# EAGLE design Shield (EAGLE 7.2.0)
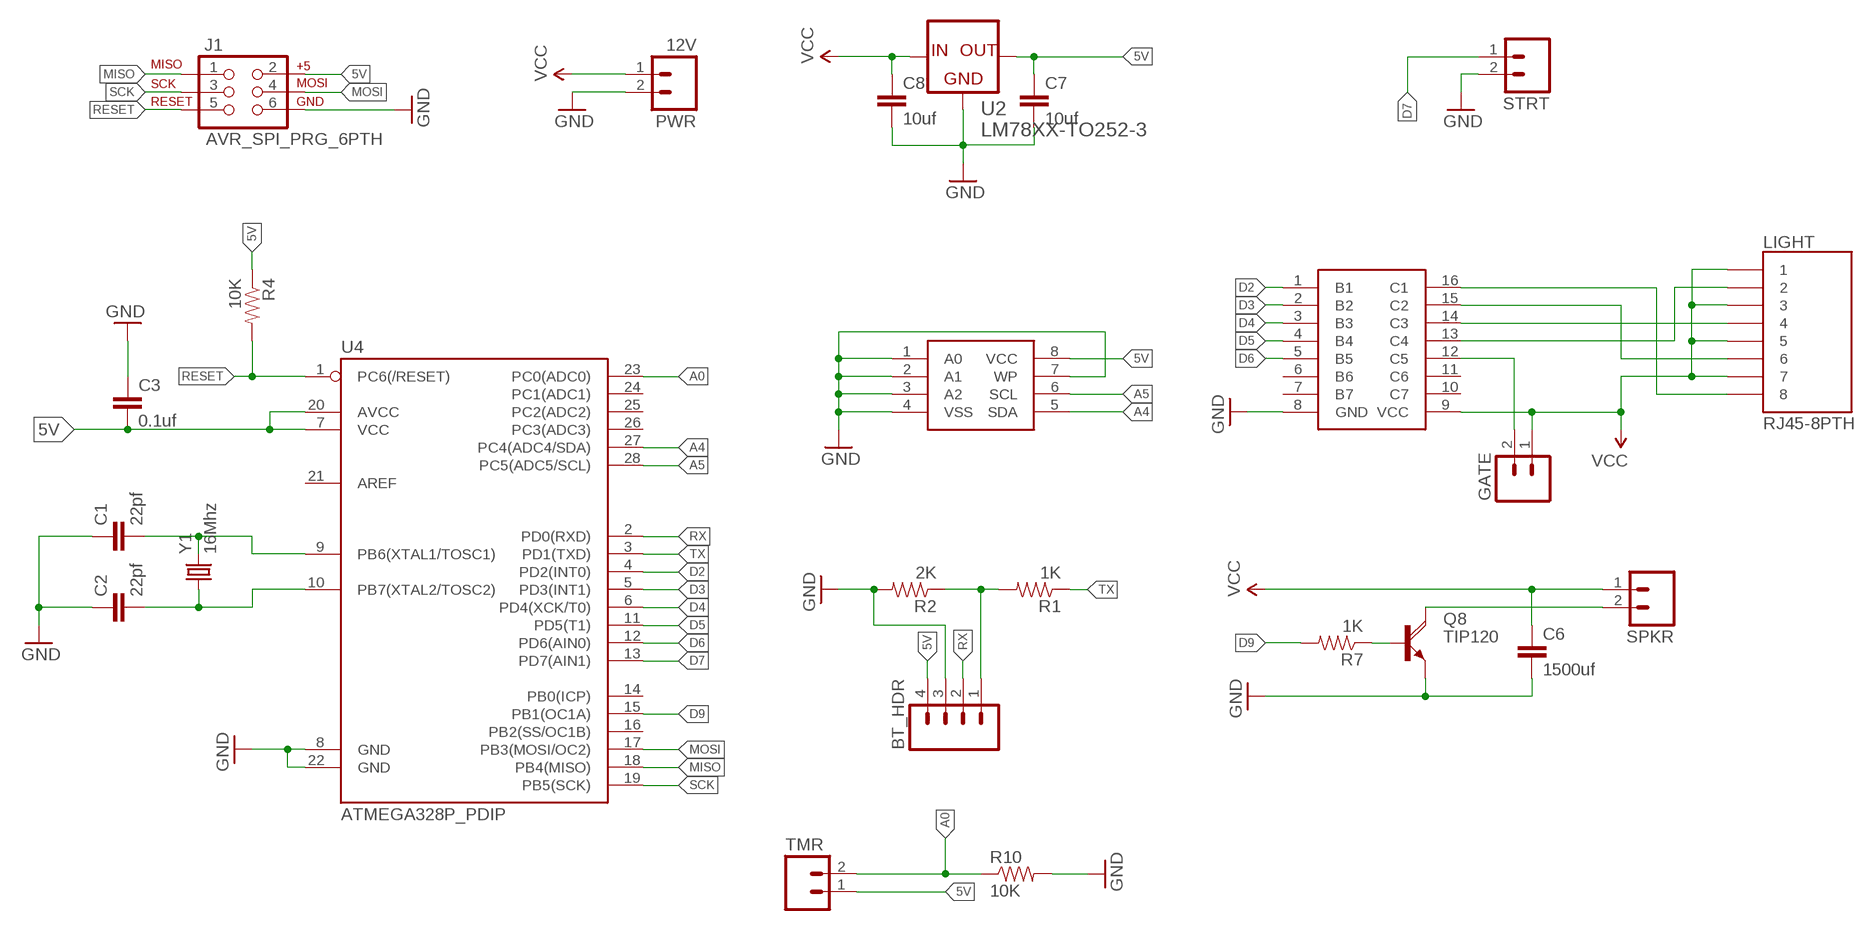
[diagram p0: schematic, sheet 1]

## Parts
BT_HDR  M04PTH  [1X04]
C1  22pf  CAP1206  [1206]
C2  22pf  CAP1206  [1206]
C3  0.1uf  CAP1206  [1206]
C6  1500uf  CAPPTH1  [CAP-PTH-5MM]
C7  10uf  CAPPTH  [CAP-PTH-SMALL]
C8  10uf  CAPPTH  [CAP-PTH-SMALL]
GATE  M023.5MM  [SCREWTERMINAL-3.5MM-2]
J1  AVR_SPI_PRG_6PTH  [2X3]
LIGHT  RJ45-8PTH  [RJ45-8]
PWR  12V  M023.5MM  [SCREWTERMINAL-3.5MM-2]
Q8  TIP120  [TO220V]
R1  1K  RESISTOR1206  [1206]
R2  2K  RESISTOR1206  [1206]
R4  10K  RESISTOR1206  [1206]
R7  1K  RESISTOR1206  [1206]
R10  10K  RESISTOR1206  [1206]
SPKR  M023.5MM  [SCREWTERMINAL-3.5MM-2]
STRT  M023.5MM  [SCREWTERMINAL-3.5MM-2]
TMR  M023.5MM  [SCREWTERMINAL-3.5MM-2]
U2  LM78XX-TO252-3  [TO252-3]
U4  ATMEGA328P_PDIP  [DIL28-3]
U$1  MC1413D  [SO016]
U$2  24AAXXX  [SOIC-8-EIAJ]
Y1  16Mhz  CRYSTALHC49US  [HC49US]

## Nets
5V: BT_HDR.4 C3.2 C7.1 J1.2 R4.1 TMR.1 U2.3(OUT) U4.7(VCC) U4.20(AVCC) U$2.8(VCC)
A0: R10.1 TMR.2 U4.23(PC0(ADC0))
A4: U4.27(PC4(ADC4/SDA)) U$2.5(SDA)
A5: U4.28(PC5(ADC5/SCL)) U$2.6(SCL)
D2: U4.4(PD2(INT0)) U$1.1(B1)
D3: U4.5(PD3(INT1)) U$1.2(B2)
D4: U4.6(PD4(XCK/T0)) U$1.3(B3)
D5: U4.11(PD5(T1)) U$1.4(B4)
D6: U4.12(PD6(AIN0)) U$1.5(B5)
D7: STRT.1 U4.13(PD7(AIN1))
D9: R7.2 U4.15(PB1(OC1A))
GATE: GATE.2 U$1.12(C5)
GND: BT_HDR.3 C1.1 C2.1 C3.1 C6.2 C7.2 C8.2 J1.6 PWR.2 Q8.3(E) R2.2 R10.2 STRT.2 U2.2(COM) U4.8(GND) U4.22(GND) U$1.8(GND) U$2.1(A0) U$2.2(A1) U$2.3(A2) U$2.4(VSS) U$2.7(WP)
MISO: J1.1 U4.18(PB4(MISO))
MOSI: J1.4 U4.17(PB3(MOSI/OC2))
N$1: BT_HDR.1 R1.2 R2.1
N$2: LIGHT.8 U$1.16(C1)
N$3: LIGHT.6 U$1.15(C2)
N$4: LIGHT.4 U$1.14(C3)
N$5: LIGHT.2 U$1.13(C4)
N$12: Q8.2(C) SPKR.2
N$15: C1.2 U4.9(PB6(XTAL1/TOSC1)) Y1.2
N$19: Q8.1(B) R7.1
N$24: C2.2 U4.10(PB7(XTAL2/TOSC2)) Y1.1
RESET: J1.5 R4.2 U4.1(PC6(/RESET))
RX: BT_HDR.2 U4.2(PD0(RXD))
SCK: J1.3 U4.19(PB5(SCK))
TX: R1.1 U4.3(PD1(TXD))
VCC: C6.1 C8.1 GATE.1 LIGHT.1 LIGHT.3 LIGHT.5 LIGHT.7 PWR.1 SPKR.1 U2.1(IN) U$1.9(VCC)
Unconnected: U4.14(PB0(ICP)) U4.16(PB2(SS/OC1B)) U4.21(AREF) U4.24(PC1(ADC1)) U4.25(PC2(ADC2)) U4.26(PC3(ADC3)) U$1.6(B6) U$1.7(B7) U$1.10(C7) U$1.11(C6)

## Library data of the parts
BT_HDR = SparkFun-Connectors:M04: Header 4 Standard 4-pin 0.1" header. Use with straight break away headers (SKU : PRT-00116), right angle break away headers (PRT-00553), swiss pins (PRT-00743), machine pins (PRT-00117), and female headers (PRT-00115). Molex polarized connector foot print use with SKU : PRT-08231 with associated crimp pins and housings. 1MM SMD Version SKU: PRT-10208
C1-C3 C6-C8 = SparkFun-Capacitors:CAP: Capacitor Standard 0603 ceramic capacitor, and 0.1" leaded capacitor.
GATE PWR SPKR STRT TMR = SparkFun-Connectors:M02: Header 2 Standard 2-pin 0.1" header. Use with straight break away headers (SKU : PRT-00116), right angle break away headers (PRT-00553), swiss pins (PRT-00743), machine pins (PRT-00117), and female headers (PRT-00115). Molex polarized connector foot print use with SKU : PRT-08233 with associated crimp pins and housings.
J1 = SparkFun-Connectors:AVR_SPI_PRG_6: AVR ISP 6 Pin This is the reduced ISP connector for AVR programming. Common on Arduino. This footprint will take up less PCB space and can be used with a 10-pin to 6-pin adapter such as SKU: BOB-08508 **Special note about "TEST_POINT" package. The stop mask is on the top side, so if you want your programming test points to be on the bottom of your board, make sure to place this package on the bottom side of the board. This also ensure that the orientation to program from the bottom side will be correct.
LIGHT = SparkFun-Connectors:RJ45-8: RJ45 Jack Simple RJ45, 8-pin connection - connector for common Cat5, Cat5e, and Cat6 Ethernet cables. Footprint not yet proven in production. Connector sku is PRT-00643; Breakout PCB sku is BOB-00716.
Q8 = ucigate:TIP120: NPN DARLINGTON TRANSISTOR
R1 R2 R4 R7 R10 = SparkFun-Passives:RESISTOR: Resistor Basic schematic elements and footprints for 0603, 1206, and PTH resistors.
U2 = element14-com:LM78XX-TO252-3: IC, POSITIVE-VOLTAGE REGULATORS, 3.3V, 3-TO-252; MPN: UA78M33CKVURG3; OC_FARNELL: 2075446; OC_NEWARK: 80K3502; PACKAGE: 3-TO-252; SUPPLIER: TEXAS INSTRUMENTS
U4 = SparkFun-DigitalIC:ATMEGA328P_PDIP: uC used in the Arduino 32kb flash, 1k EEPROM, 2k SRAM This is the through-hole version of this chip.
U$1 = ucigate:MC1413D
U$2 = ucigate:24AAXXX
Y1 = SparkFun-FreqCtrl:CRYSTAL: Various standard crystals. Proven footprints. Spark Fun Electronics SKU : COM-00534

## Net classes
0 default: width 0.381 mm

## Board
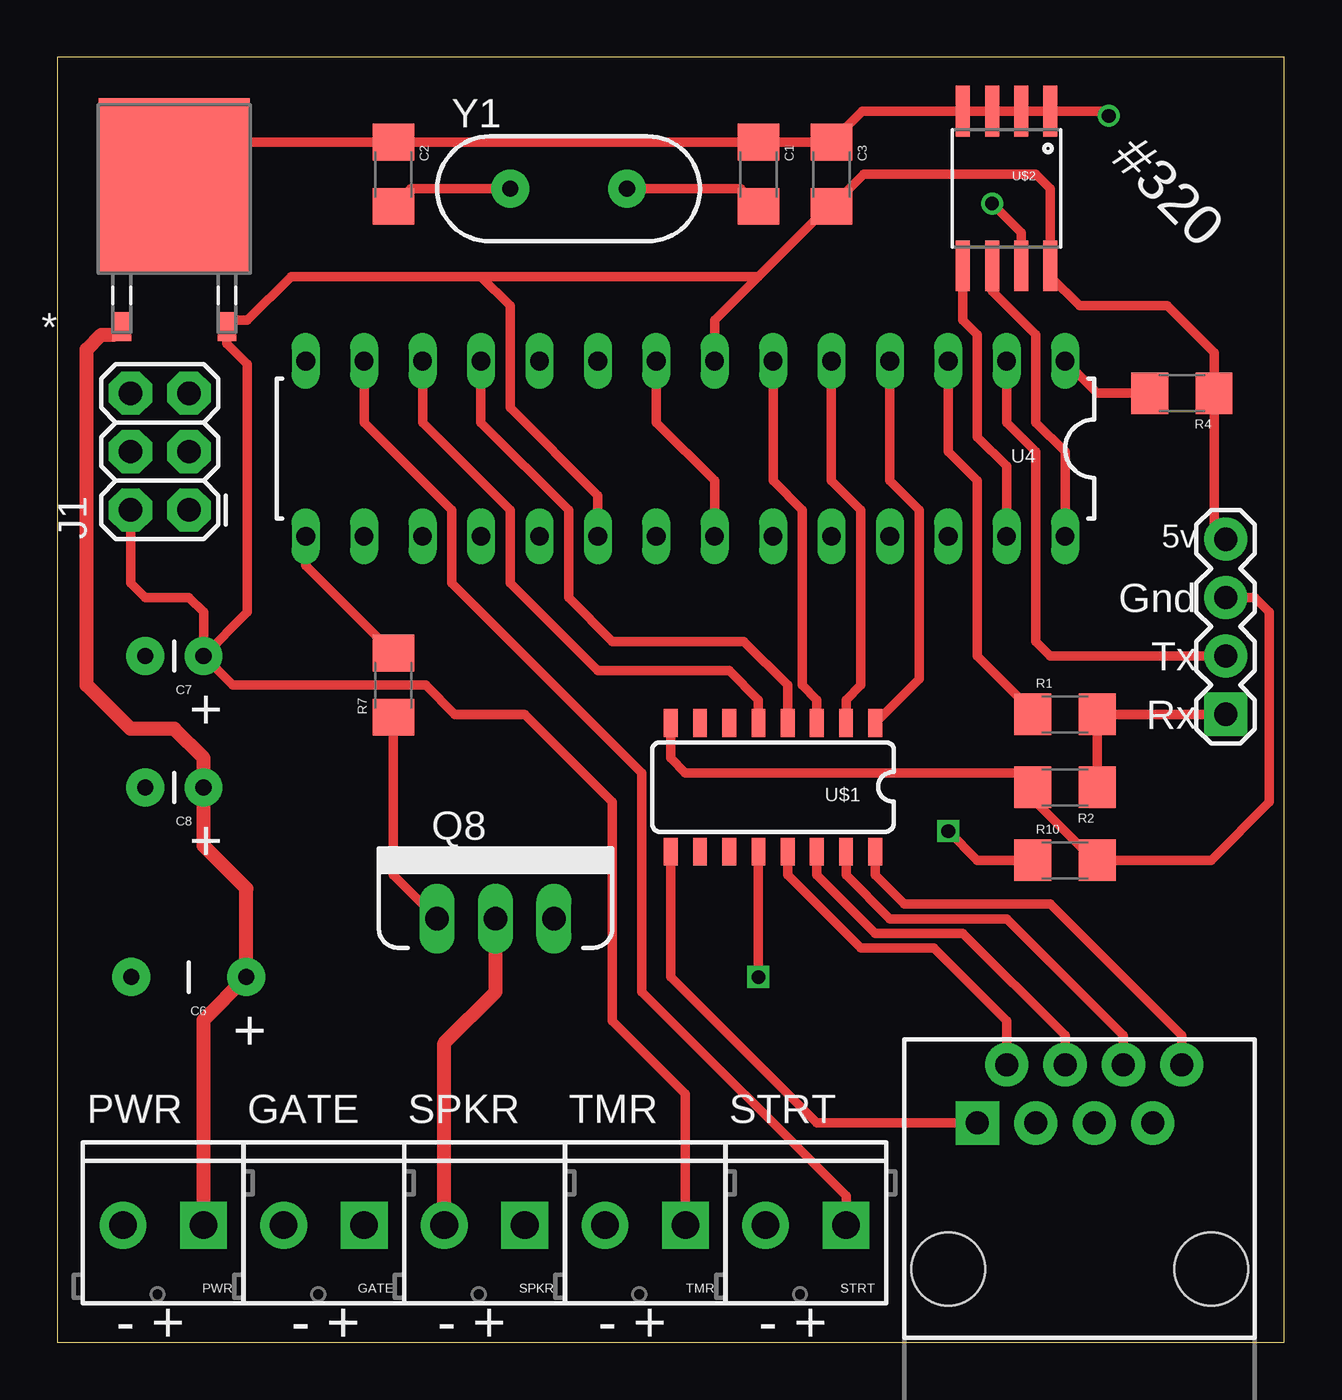
[diagram p1: board, top side]
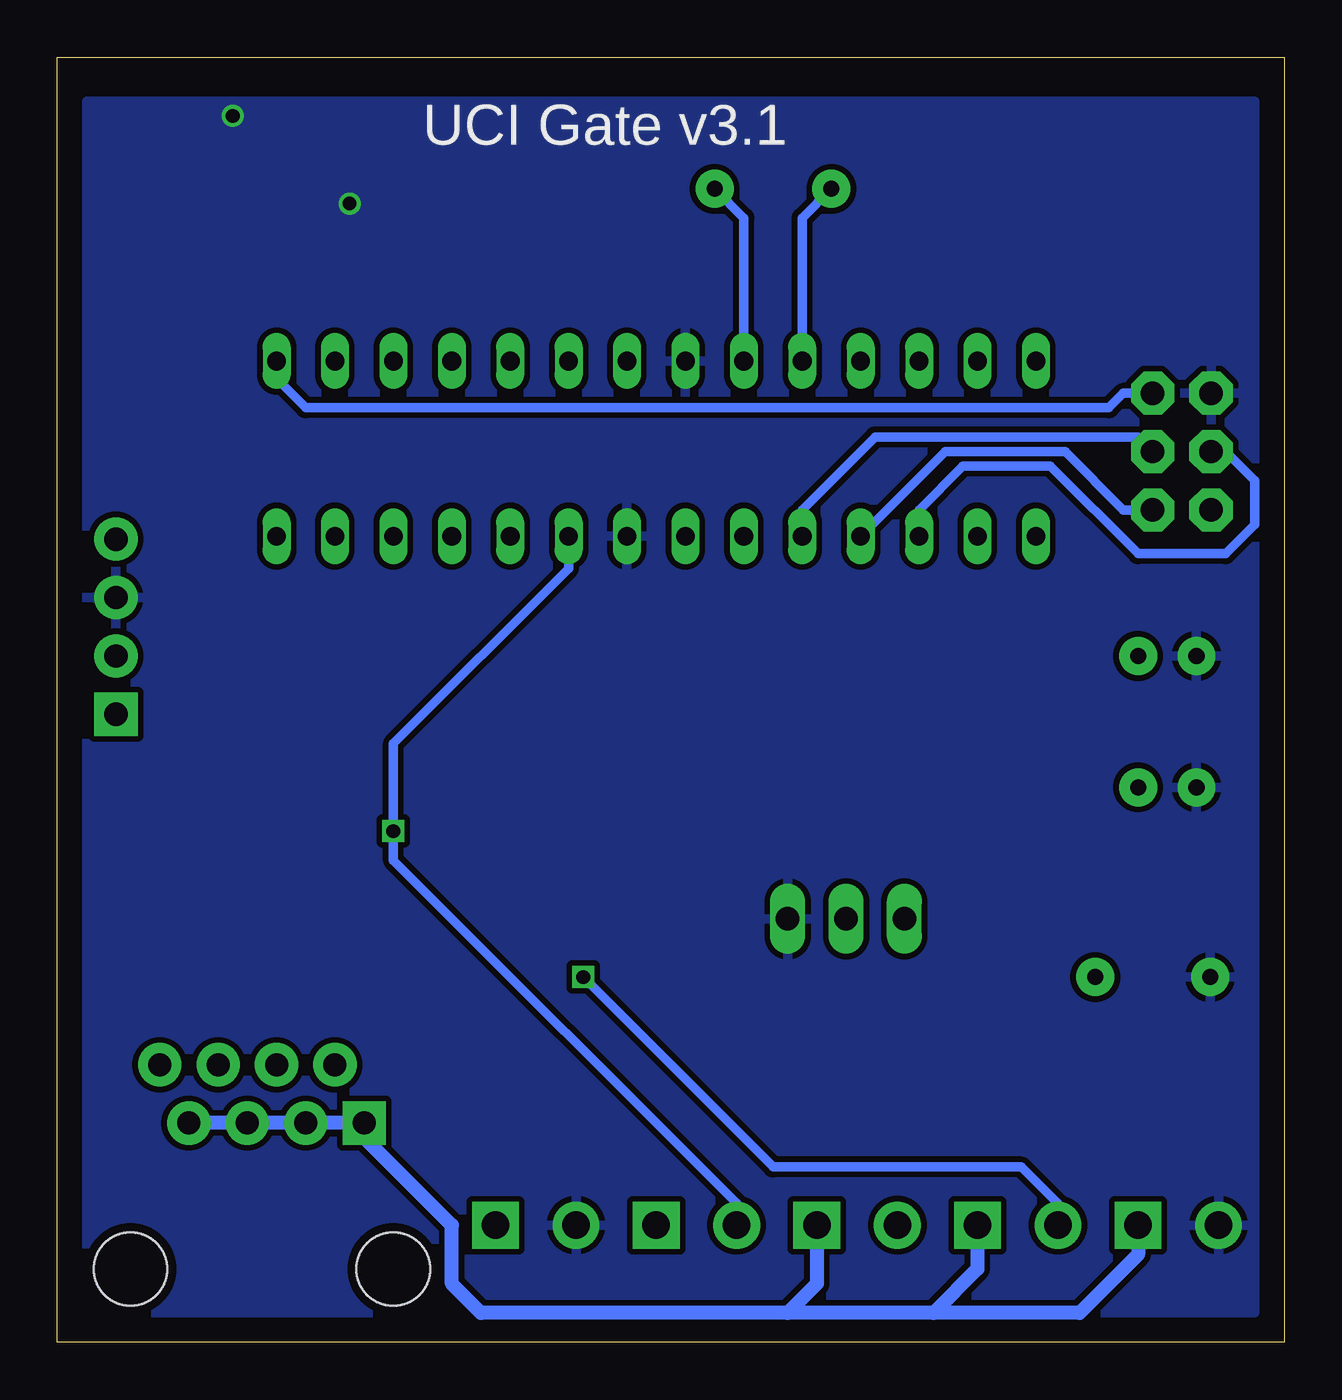
[diagram p2: board, bottom side, seen from below]

Size 53.34 x 55.88 mm. Coordinates in mm from the lower left corner, seen from the top.
Outline: 0,0 53.34,0 53.34,55.88 0,55.88 0,0
Copper layers (1*16): Top 0.0356mm / dielectric 1.5011mm / Bottom 0.0356mm
Design rules "LaenPCBOrder": minimum track width 6mil, minimum drill 13mil, track to track 6mil, track to pad 6mil, pad to pad 6mil, via to via 6mil, smd to smd 6mil, copper to edge 15mil, drill to drill 6mil, minimum pad ring 7mil, minimum via ring 7mil, stop-mask expansion 4mil, vias tented up to drill 0mil, thermal gap 10mil

### Footprints (pad centres in the part's own frame; a part is rotated, then mirrored left to right if it is on the bottom)
1X04 = drill 1.016 pad 1.88 square: 1 0,0 | drill 1.016 pad 1.88: 2 2.54,0; 3 5.08,0; 4 7.62,0
1206 = smd 1.6 x 1.8: 1 -1.4,0; 2 1.4,0
CAP-PTH-5MM = drill 0.7 pad 1.651: 1 -2.5,0; 2 2.5,0
CAP-PTH-SMALL = drill 0.7 pad 1.651: 1 0,0; 2 2.54,0
SCREWTERMINAL-3.5MM-2 = drill 1.2 pad 2.032 square: 1 0,0 | drill 1.2 pad 2.032: 2 3.5,0
2X3 = drill 1.016 pad 1.88 octagon: 1 0,0; 2 0,2.54; 3 2.54,0; 4 2.54,2.54; 5 5.08,0; 6 5.08,2.54
RJ45-8 = drill 1 pad 1.88 square: 1 -4.445,6.35 | drill 1 pad 1.88: 2 -3.175,8.89; 3 -1.905,6.35; 4 -0.635,8.89; 5 0.635,6.35; 6 1.905,8.89; 7 3.175,6.35; 8 4.445,8.89 | hole 3.2: -5.715,0; 5.715,0
TO220V = drill 1.016 long: 1 -2.54,0; 2 0,0; 3 2.54,0
TO252-3 = smd 0.813 x 1.27: 1 -2.286,-5.994; 3 2.286,-5.994 | smd 6.579 x 7.595: 2 0,0.152
DIL28-3 = drill 0.813 long: 1 -16.51,-3.81; 2 -13.97,-3.81; 3 -11.43,-3.81; 4 -8.89,-3.81; 5 -6.35,-3.81; 6 -3.81,-3.81; 7 -1.27,-3.81; 8 1.27,-3.81; 9 3.81,-3.81; 10 6.35,-3.81; 11 8.89,-3.81; 12 11.43,-3.81; 13 13.97,-3.81; 14 16.51,-3.81; 15 16.51,3.81; 16 13.97,3.81; 17 11.43,3.81; 18 8.89,3.81; 19 6.35,3.81; 20 3.81,3.81; 21 1.27,3.81; 22 -1.27,3.81; 23 -3.81,3.81; 24 -6.35,3.81; 25 -8.89,3.81; 26 -11.43,3.81; 27 -13.97,3.81; 28 -16.51,3.81
SO016 = smd 0.6 x 1.2: 1 -4.445,-2.8; 2 -3.175,-2.8; 3 -1.905,-2.8; 4 -0.635,-2.8; 5 0.635,-2.8; 6 1.905,-2.8; 7 3.175,-2.8; 8 4.445,-2.8; 9 4.445,2.8; 10 3.175,2.8; 11 1.905,2.8; 12 0.635,2.8; 13 -0.635,2.8; 14 -1.905,2.8; 15 -3.175,2.8; 16 -4.445,2.8
SOIC-8-EIAJ = smd 0.61 x 2.21: 1 -1.905,-3.378; 2 -0.635,-3.378; 3 0.635,-3.378; 4 1.905,-3.378; 5 1.905,3.353; 6 0.635,3.353; 7 -0.635,3.353; 8 -1.905,3.353
HC49US = drill 0.7 pad 1.651: 1 -2.54,0; 2 2.54,0

### Placement (x,y rotation side)
BT_HDR  50.8,27.3 90 top
C1  30.48,50.8 270 top
C2  14.61,50.8 270 top
C3  33.66,50.8 270 top
C6  5.71,15.88 180 top
C7  6.35,29.84 180 top
C8  6.35,24.13 180 top
GATE  13.34,5.08 180 top
J1  5.71,36.2 90 top
LIGHT  44.45,3.17 0 top
PWR  6.35,5.08 180 top
Q8  19.05,18.41 0 top
R1  43.81,27.3 0 top
R2  43.81,24.13 180 top
R4  48.9,41.27 180 top
R7  14.61,28.57 90 top
R10  43.81,20.95 0 top
SPKR  20.32,5.08 180 top
STRT  34.29,5.08 180 top
TMR  27.3,5.08 180 top
U2  5.08,50.16 0 top
U4  27.3,38.86 180 top
U$1  31.11,24.13 180 top
U$2  41.27,50.16 180 top
Y1  22.23,50.16 0 top

### Tracks (layer width: path | path; a pad name or v marks a point on that pad's centre or on a via)
5V
  Top 0.406: BT_HDR.4 50.3,35.43 R4.1 50.3,43.05 48.26,45.09 44.45,45.09 43.18,46.35 U$2.8 43.18,50.16 42.55,50.8 35.05,50.8 C3.2 33.52,49.4 30.48,46.35 | 30.48,46.35 18.41,46.35 | 18.41,46.35 10.16,46.35 8.26,44.45 7.64,44.45 U2.3 7.37,43.43 8.26,42.55 8.26,31.75 C7.1 | U4.7 28.57,44.45 30.48,46.35 | U4.20 23.5,36.83 19.68,40.64 19.68,45.09 18.41,46.35 | TMR.1 27.3,10.79 24.13,13.97 24.13,23.5 20.32,27.3 17.27,27.3 16,28.57 7.62,28.57 C7.1 | C7.1 6.35,31.75 5.71,32.38 3.81,32.38 3.17,33.02 J1.2
A0  (via drill 0.6)
  Top 0.406: R10.1 40.01,20.95 v38.73,22.23
  Bottom 0.406: TMR.2 23.8,6.03 38.73,20.95 v38.73,22.23 38.73,26.04 31.11,33.66 U4.23
A4
  Top 0.406: U4.27 41.27,38.1 40.01,39.37 40.01,43.81 39.37,44.45 U$2.5
A5
  Top 0.406: U4.28 43.81,38.73 42.55,40.01 42.55,43.81 40.64,45.72 U$2.6
D2
  Top 0.406: U4.4 36.2,37.47 37.47,36.2 37.47,28.84 U$1.1
D3
  Top 0.406: U4.5 33.66,37.47 34.92,36.2 34.92,28.57 34.29,27.94 U$1.2
D4
  Top 0.406: U4.6 31.11,37.47 32.38,36.2 32.38,28.57 33.02,27.94 U$1.3
D5
  Top 0.406: U$1.4 31.75,28.57 29.84,30.48 24.13,30.48 22.23,32.38 22.23,36.2 18.41,40.01 U4.11
D6
  Top 0.406: U$1.5 30.48,27.94 29.21,29.21 23.5,29.21 19.68,33.02 19.68,36.2 15.88,40.01 U4.12
D7
  Top 0.406: STRT.1 34.29,6.35 25.4,15.24 25.4,24.77 17.14,33.02 17.14,36.2 13.34,40.01 U4.13
D9
  Top 0.406: R7.2 10.79,33.78 U4.15
GATE  (via drill 0.6)
  Top 0.406: v30.48,15.88 U$1.12
  Bottom 0.406: GATE.2 9.84,6.03 11.43,7.62 22.23,7.62 v30.48,15.88
GND  (via drill 0.6)
  Top 0.381: 50.8,32.77 BT_HDR.3 | 43.18,53.34 U$2.1
  Top 0.406: U2.2 5.74,52.2 C2.1 C1.1 C3.1 35,53.54 U$2.4 U$2.3 U$2.2 U$2.1 45.52,53.54 v45.72,53.34 | U4.8 26.04,40.01 28.57,37.47 U4.22 | BT_HDR.3 52.07,32.38 52.7,31.75 52.7,23.5 50.16,20.95 R10.2 45.09,20.95 42.55,23.5 42.55,24 R2.2 41.78,24.77 27.3,24.77 26.67,25.4 U$1.8 | U$2.7 41.91,48.26 v40.64,49.53
  pour Bottom (isolate 0.254): 1.27,53.98 52.07,53.98 52.07,1.27 1.27,1.27
MISO
  Bottom 0.406: J1.1 6.99,36.2 9.53,38.73 14.73,38.73 U4.18
MOSI
  Bottom 0.406: J1.4 2.54,38.73 1.27,37.47 1.27,35.56 2.54,34.29 6.35,34.29 10.16,38.1 13.97,38.1 15.88,36.2 U4.17
N$1
  Top 0.406: R2.1 R1.2 BT_HDR.1
N$2
  Top 0.406: U$1.16 35.56,20.32 36.83,19.05 43.18,19.05 48.9,13.34 LIGHT.8
N$3
  Top 0.406: LIGHT.6 46.35,13.34 41.27,18.41 36.2,18.41 34.29,20.32 U$1.15
N$4
  Top 0.406: U$1.14 33.02,20.32 35.56,17.78 39.37,17.78 43.81,13.34 LIGHT.4
N$5
  Top 0.406: LIGHT.2 41.27,13.97 38.1,17.14 34.92,17.14 31.75,20.32 U$1.13
N$12
  Top 0.61: SPKR.2 16.82,13.01 19.05,15.24 Q8.2
N$15
  Top 0.406: Y1.2 29.71,50.16 C1.2
  Bottom 0.406: U4.9 23.5,48.9 Y1.2
N$19
  Top 0.406: R7.1 14.61,20.32 Q8.1
N$24
  Top 0.406: Y1.1 15.37,50.16 C2.2
  Bottom 0.406: U4.10 20.95,48.9 Y1.1
RESET
  Top 0.406: R4.2 45.21,41.27 U4.1
  Bottom 0.406: J1.5 6.99,41.27 7.62,40.64 42.55,40.64 43.81,41.91 U4.1 44.2,42.29
RX
  Top 0.406: U4.2 41.27,40.01 42.55,38.73 42.55,30.48 43.18,29.84 BT_HDR.2
SCK
  Bottom 0.406: U4.19 20.95,36.2 17.78,39.37 6.35,39.37 J1.3
TX
  Top 0.406: U4.3 38.73,38.73 40.01,37.47 40.01,29.84 42.41,27.43 R1.1
VCC
  Top 0.406: U$1.9 26.67,15.88 33.02,9.53 LIGHT.1
  Top 0.61: U2.1 2.44,43.81 1.91,43.81 1.27,43.18 1.27,28.57 3.17,26.67 5.08,26.67 6.35,25.4 C8.1 6.35,21.59 8.21,19.73 C6.1 6.35,14.01 PWR.1
  Bottom 0.61: PWR.1 6.35,3.81 8.89,1.27 15.24,1.27 | 15.24,1.27 21.59,1.27 | 21.59,1.27 34.92,1.27 36.2,2.54 36.2,5.08 40.01,8.89 LIGHT.1 LIGHT.3 LIGHT.5 LIGHT.7 | GATE.1 13.34,3.17 15.24,1.27 | SPKR.1 20.32,2.54 21.59,1.27

### Text on the board
tPlace: #320 | 5v | Gnd | Tx | Rx | + | + | + | PWR | GATE | SPKR | TMR | STRT | - + | - + | - + | - + | - + | - +
bPlace: UCI Gate v3.1